# EAGLE design beagle2can (EAGLE 7.7.0)

## Sheet 1 of 2
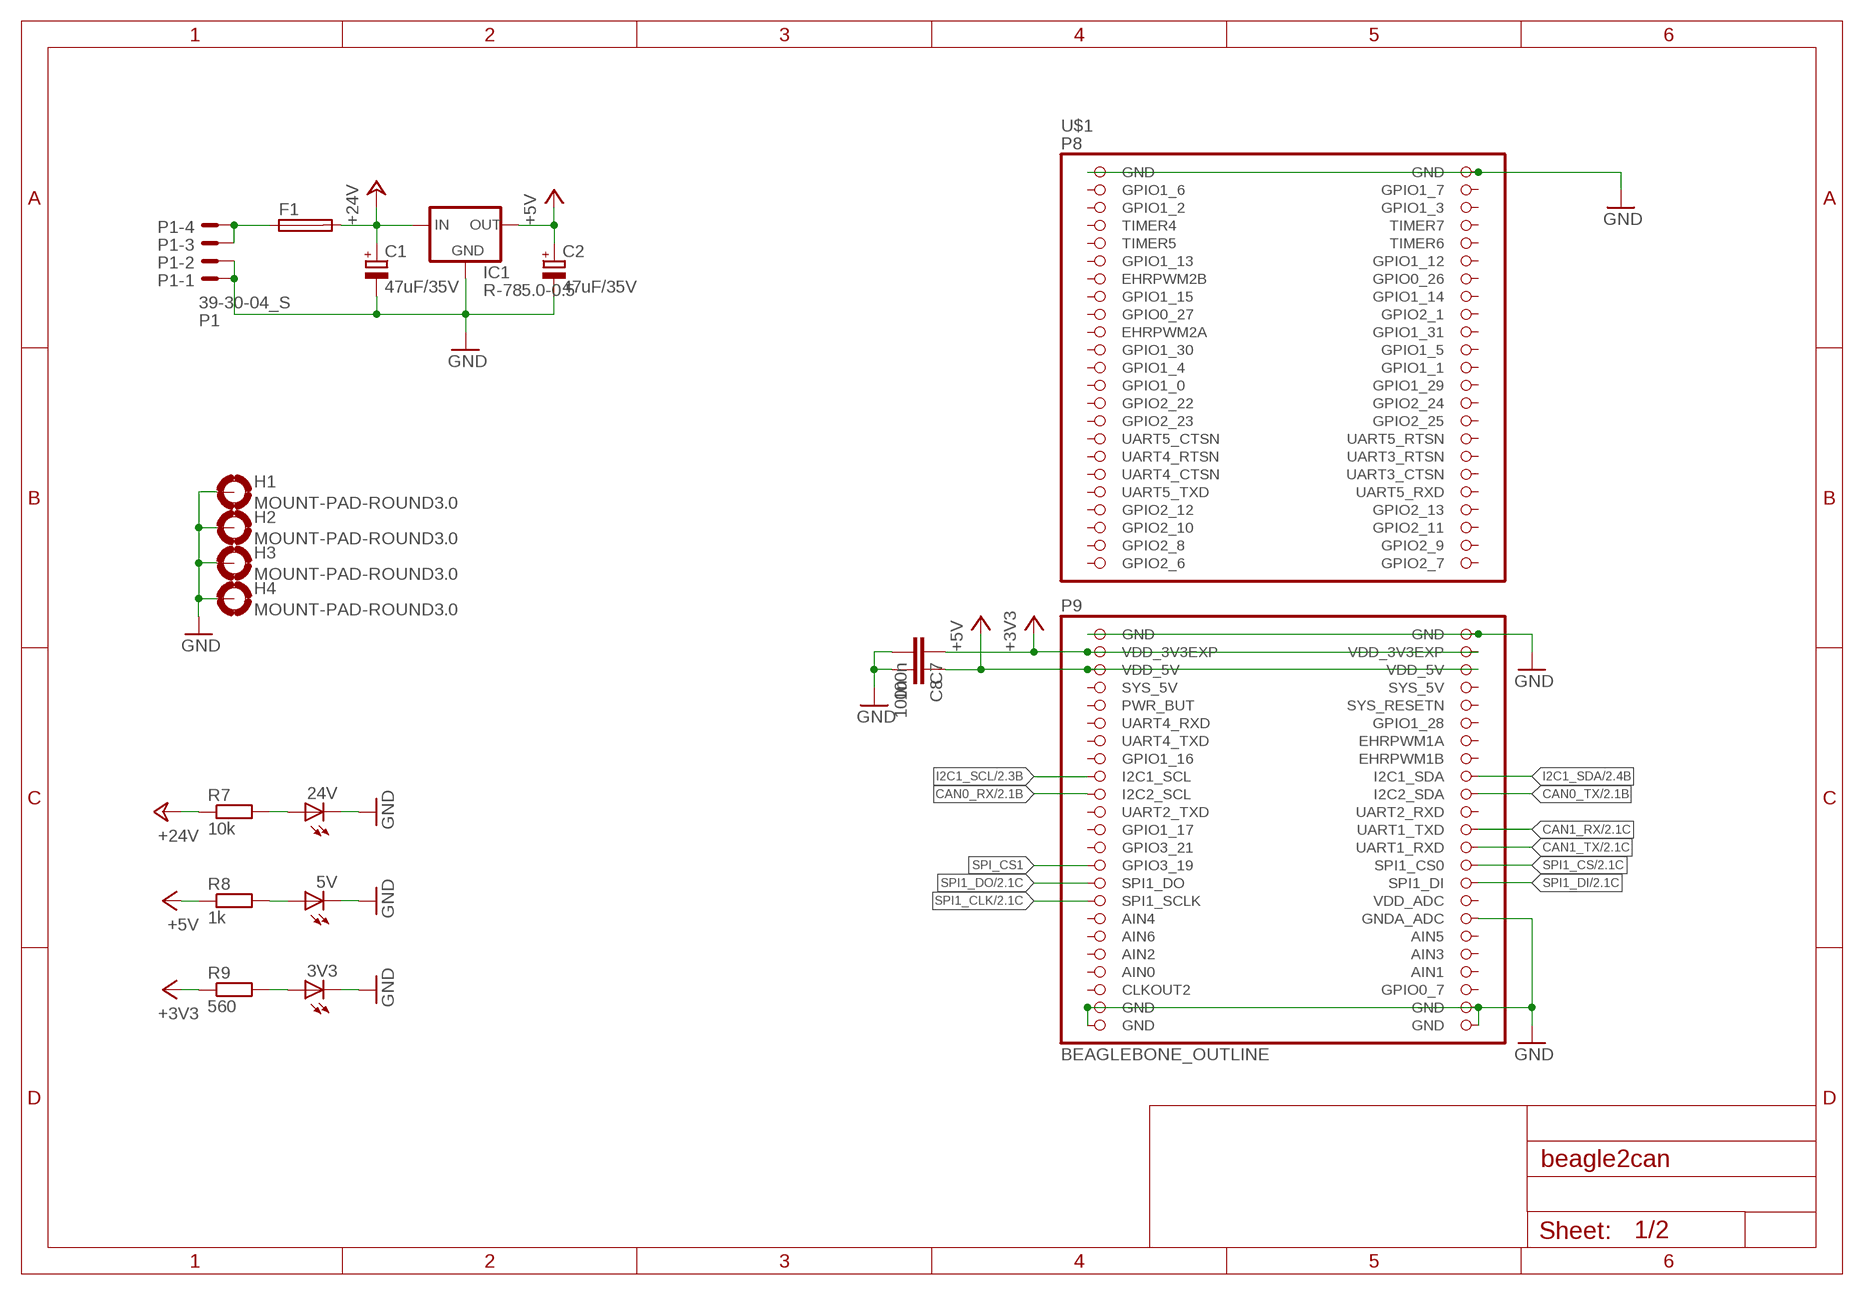
[diagram p0: schematic, sheet 1]

### Parts
3V3  LEDCHIP-LED0805  [CHIP-LED0805]
5V  LEDCHIP-LED0805  [CHIP-LED0805]
24V  LEDCHIP-LED0805  [CHIP-LED0805]
C1  47uF/35V  CPOL-EUD  [PANASONIC_D]
C2  47uF/35V  CPOL-EUD  [PANASONIC_D]
C7  100n  C-EUC0603  [C0603]
C8  100n  C-EUC0603  [C0603]
F1  TE5  [TE5]
H1  MOUNT-PAD-ROUND3.0  [3,0-PAD]
H2  MOUNT-PAD-ROUND3.0  [3,0-PAD]
H3  MOUNT-PAD-ROUND3.0  [3,0-PAD]
H4  MOUNT-PAD-ROUND3.0  [3,0-PAD]
IC1  R-785.0-0.5  [SIP3]
P1  39-30-04_S  [39-30-?04?]
R7  10k  R-EU_R0805  [R0805]
R8  1k  R-EU_R0805  [R0805]
R9  560  R-EU_R0805  [R0805]
U$1  BEAGLEBONE_OUTLINE  [BEAGLEBONE_SHIELD]

### Nets
+3V3: C7.1 R9.1 U$1.49(VDD_3V3EXP) U$1.50(VDD_3V3EXP) ; also sheet 2
+5V: C2.+ C8.1 IC1.3(OUT) R8.1 U$1.51(VDD_5V) U$1.52(VDD_5V) ; also sheet 2
+24V: C1.+ F1.2 IC1.1(IN) R7.1
CAN0_RX: U$1.65(I2C2_SCL) ; also sheet 2
CAN0_TX: U$1.66(I2C2_SDA) ; also sheet 2
CAN1_RX: U$1.70(UART1_TXD) ; also sheet 2
CAN1_TX: U$1.72(UART1_RXD) ; also sheet 2
CON_24V: F1.1 P1.3 P1.4 ; also sheet 2
GND: 3V3.C 5V.C 24V.C C1.- C2.- C7.2 C8.2 H1.B3,0(MOUNT) H2.B3,0(MOUNT) H3.B3,0(MOUNT) H4.B3,0(MOUNT) IC1.2(GND) P1.1 P1.2 U$1.1(GND) U$1.2(GND) U$1.47(GND) U$1.48(GND) U$1.80(GNDA_ADC) U$1.89(GND) U$1.90(GND) U$1.91(GND) U$1.92(GND) ; also sheet 2
I2C1_SCL: U$1.63(I2C1_SCL) ; also sheet 2
I2C1_SDA: U$1.64(I2C1_SDA) ; also sheet 2
N$1: 5V.A R8.2
N$2: 24V.A R7.2
N$3: 3V3.A R9.2
SPI1_CLK: U$1.77(SPI1_SCLK) ; also sheet 2
SPI1_CS: U$1.74(SPI1_CS0) ; also sheet 2
SPI1_DI: U$1.76(SPI1_DI) ; also sheet 2
SPI1_DO: U$1.75(SPI1_DO) ; also sheet 2
SPI_CS1: U$1.73(GPIO3_19)
Unconnected: U$1.3(GPIO1_6) U$1.4(GPIO1_7) U$1.5(GPIO1_2) U$1.6(GPIO1_3) U$1.7(TIMER4) U$1.8(TIMER7) U$1.9(TIMER5) U$1.10(TIMER6) U$1.11(GPIO1_13) U$1.12(GPIO1_12) U$1.13(EHRPWM2B) U$1.14(GPIO0_26) U$1.15(GPIO1_15) U$1.16(GPIO1_14) U$1.17(GPIO0_27) U$1.18(GPIO2_1) U$1.19(EHRPWM2A) U$1.20(GPIO1_31) U$1.21(GPIO1_30) U$1.22(GPIO1_5) U$1.23(GPIO1_4) U$1.24(GPIO1_1) U$1.25(GPIO1_0) U$1.26(GPIO1_29) U$1.27(GPIO2_22) U$1.28(GPIO2_24) U$1.29(GPIO2_23) U$1.30(GPIO2_25) U$1.31(UART5_CTSN) U$1.32(UART5_RTSN) U$1.33(UART4_RTSN) U$1.34(UART3_RTSN) U$1.35(UART4_CTSN) U$1.36(UART3_CTSN) U$1.37(UART5_TXD) U$1.38(UART5_RXD) U$1.39(GPIO2_12) U$1.40(GPIO2_13) U$1.41(GPIO2_10) U$1.42(GPIO2_11) U$1.43(GPIO2_8) U$1.44(GPIO2_9) U$1.45(GPIO2_6) U$1.46(GPIO2_7) U$1.54(SYS_5V) U$1.55(PWR_BUT) U$1.56(SYS_RESETN) U$1.57(UART4_RXD) U$1.58(GPIO1_28) U$1.59(UART4_TXD) U$1.60(EHRPWM1A) U$1.61(GPIO1_16) U$1.62(EHRPWM1B) U$1.67(UART2_TXD) U$1.68(UART2_RXD) U$1.69(GPIO1_17) U$1.71(GPIO3_21) U$1.78(VDD_ADC) U$1.79(AIN4) U$1.81(AIN6) U$1.82(AIN5) U$1.83(AIN2) U$1.84(AIN3) U$1.86(AIN1) U$1.87(CLKOUT2) U$1.88(GPIO0_7)

## Sheet 2 of 2
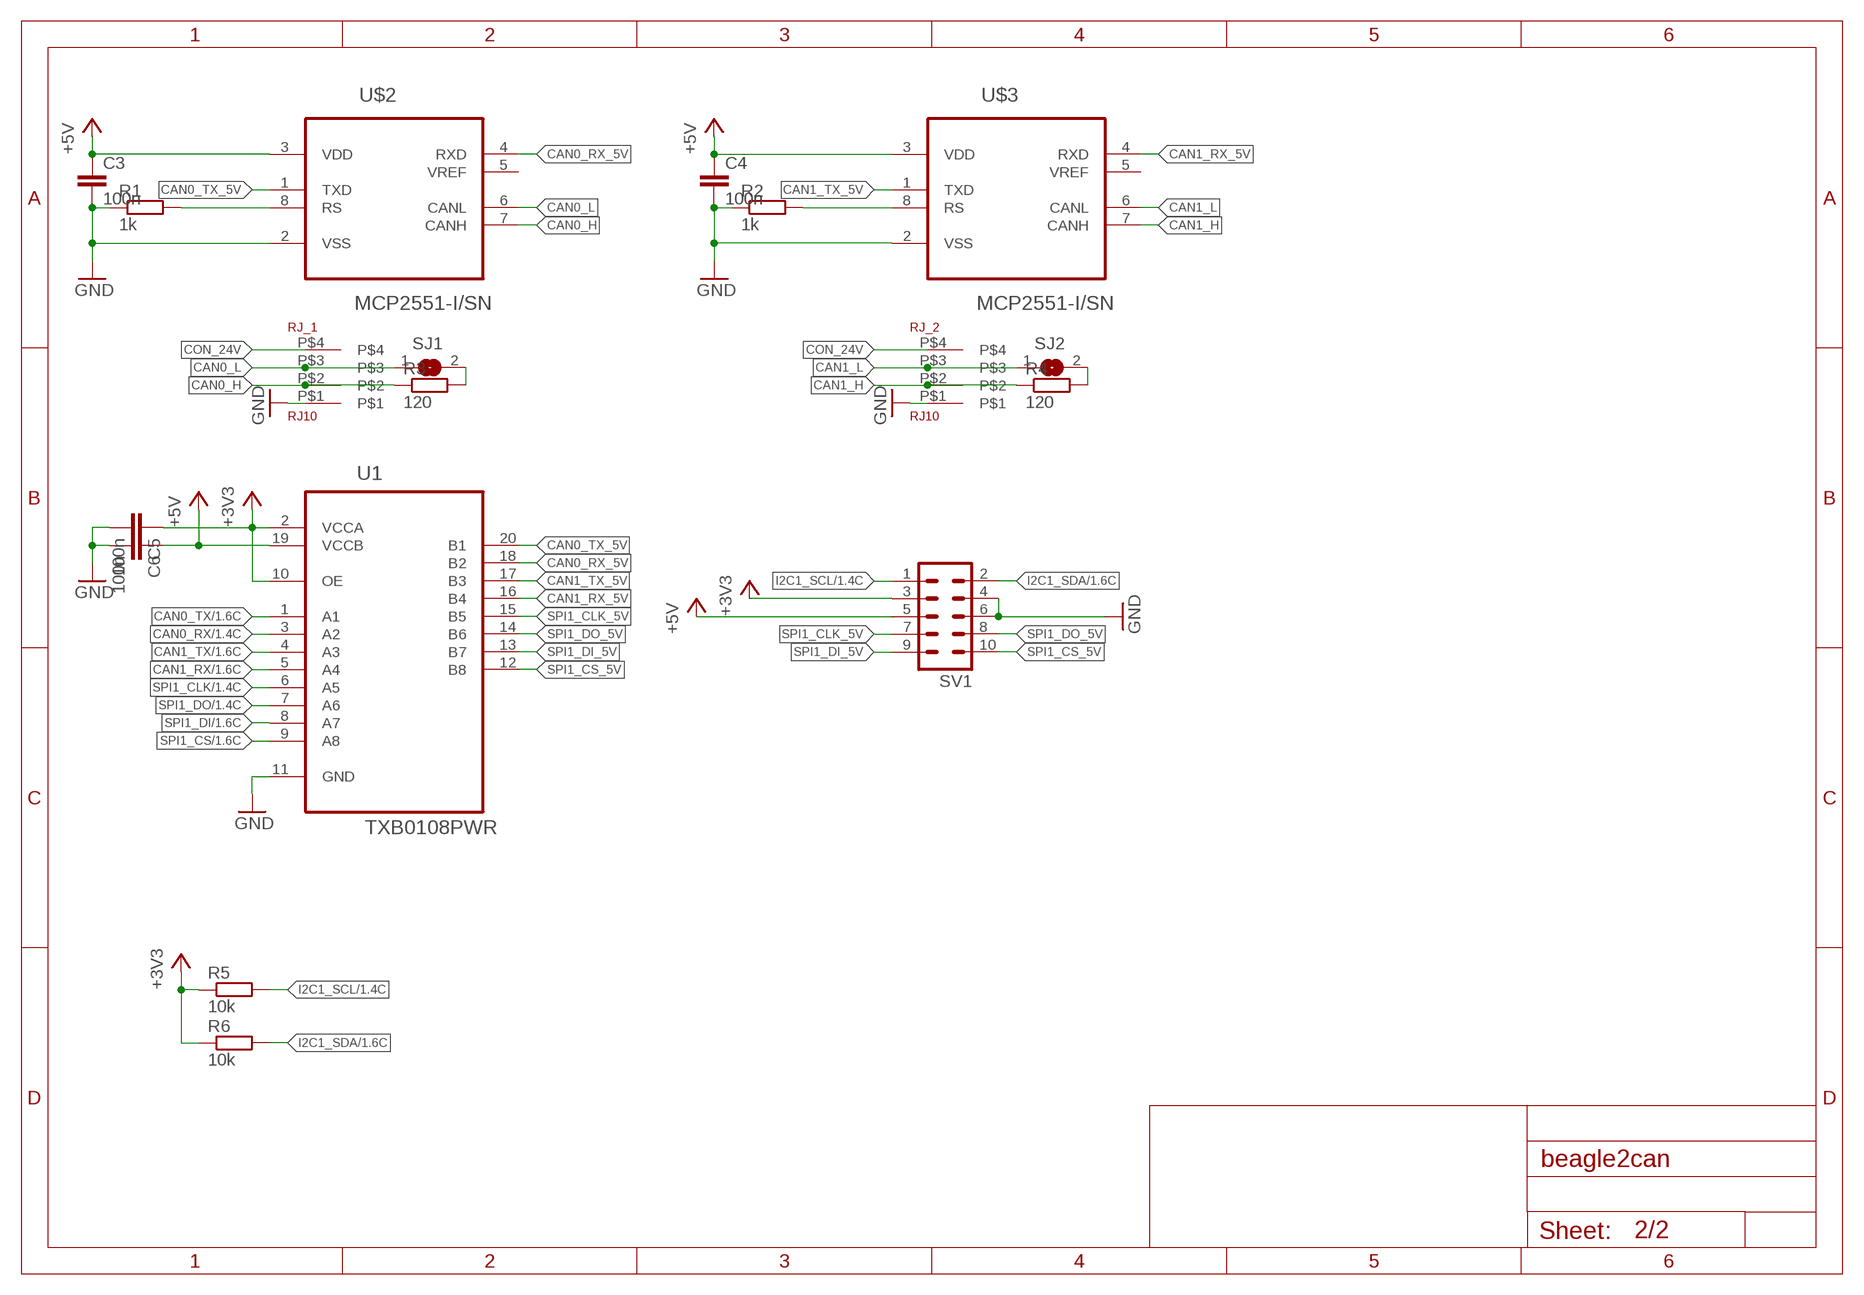
[diagram p1: schematic, sheet 2]

### Parts
C3  100n  C-EUC0603  [C0603]
C4  100n  C-EUC0603  [C0603]
C5  100n  C-EUC0603  [C0603]
C6  100n  C-EUC0603  [C0603]
R1  1k  R-EU_R0805  [R0805]
R2  1k  R-EU_R0805  [R0805]
R3  120  R-EU_R0805  [R0805]
R4  120  R-EU_R0805  [R0805]
R5  10k  R-EU_R0805  [R0805]
R6  10k  R-EU_R0805  [R0805]
RJ_1  RJ10  [RJ10]
RJ_2  RJ10  [RJ10]
SJ1  SJ  [SJ]
SJ2  SJ  [SJ]
SV1  ML10L  [ML10L]
U1  TXB0108PWR  [SOP65P640X120-20N]
U$2  MCP2551-I/SN  [SOIC127P600X175-8N]
U$3  MCP2551-I/SN  [SOIC127P600X175-8N]

### Nets
+3V3: C5.1 R5.1 R6.1 SV1.3 U1.2(VCCA) U1.10(OE) ; also sheet 1
+5V: C3.1 C4.1 C6.1 SV1.5 U1.19(VCCB) U$2.3(VDD) U$3.3(VDD) ; also sheet 1
CAN0_H: R3.1 RJ_1.P$2 U$2.7(CANH)
CAN0_L: RJ_1.P$3 SJ1.1 U$2.6(CANL)
CAN0_R_TERM: R3.2 SJ1.2
CAN0_RS: R1.2 U$2.8(RS)
CAN0_RX: U1.3(A2) ; also sheet 1
CAN0_RX_5V: U1.18(B2) U$2.4(RXD)
CAN0_TX: U1.1(A1) ; also sheet 1
CAN0_TX_5V: U1.20(B1) U$2.1(TXD)
CAN1_H: R4.1 RJ_2.P$2 U$3.7(CANH)
CAN1_L: RJ_2.P$3 SJ2.1 U$3.6(CANL)
CAN1_R_TERM: R4.2 SJ2.2
CAN1_RS: R2.2 U$3.8(RS)
CAN1_RX: U1.5(A4) ; also sheet 1
CAN1_RX_5V: U1.16(B4) U$3.4(RXD)
CAN1_TX: U1.4(A3) ; also sheet 1
CAN1_TX_5V: U1.17(B3) U$3.1(TXD)
CON_24V: RJ_1.P$4 RJ_2.P$4 ; also sheet 1
GND: C3.2 C4.2 C5.2 C6.2 R1.1 R2.1 RJ_1.P$1 RJ_2.P$1 SV1.4 SV1.6 U1.11(GND) U$2.2(VSS) U$3.2(VSS) ; also sheet 1
I2C1_SCL: R5.2 SV1.1 ; also sheet 1
I2C1_SDA: R6.2 SV1.2 ; also sheet 1
SPI1_CLK: U1.6(A5) ; also sheet 1
SPI1_CLK_5V: SV1.7 U1.15(B5)
SPI1_CS: U1.9(A8) ; also sheet 1
SPI1_CS_5V: SV1.10 U1.12(B8)
SPI1_DI: U1.8(A7) ; also sheet 1
SPI1_DI_5V: SV1.9 U1.13(B7)
SPI1_DO: U1.7(A6) ; also sheet 1
SPI1_DO_5V: SV1.8 U1.14(B6)
Unconnected: U$2.5(VREF) U$3.5(VREF)

## Power pins joined to a net without a drawn wire
AIN0: U$1.85(AIN0)
SYS_5V: U$1.53(SYS_5V)

## Library data of the parts
3V3 5V 24V = led:LED: LED OSRAM: - CHIPLED LG R971, LG N971, LY N971, LG Q971, LY Q971, LO R971, LY R971 LH N974, LH R974 LS Q976, LO Q976, LY Q976 LO Q996 - Hyper CHIPLED LW Q18S LB Q993, LB Q99A, LB R99A - SideLED LS A670, LO A670, LY A670, LG A670, LP A670 LB A673, LV A673, LT A673, LW A673 LH A674 LY A675 LS A676, LA A676, LO A676, LY A676, LW A676 LS A679, LY A679, LG A679 - Hyper Micro SIDELED® LS Y876, LA Y876, LO Y876, LY Y876 LT Y87S - SmartLED LW L88C, LW L88S LB L89C, LB L89S, LG L890 LS L89K, LO L89K, LY L89K LS L896, LA L896, LO L896, LY L896 - TOPLED LS T670, LO T670, LY T670, LG T670, LP T670 LSG T670, LSP T670, LSY T670, LOP T670, LYG T670 LG T671, LOG T671, LSG T671 LB T673, LV T673, LT T673, LW T673 LH T674 LS T676, LA T676, LO T676, LY T676, LB T676, LH T676, LSB T676, LW T676 LB T67C, LV T67C, LT T67C, LS T67K, LO T67K, LY T67K, LW E67C LS E67B, LA E67B, LO E67B, LY E67B, LB E67C, LV E67C, LT E67C LW T67C LS T679, LY T679, LG T679 LS T770, LO T770, LY T770, LG T770, LP T770 LB T773, LV T773, LT T773, LW T773 LH T774 LS E675, LA E675, LY E675, LS T675 LS T776, LA T776, LO T776, LY T776, LB T776 LHGB T686 LT T68C, LB T68C - Hyper Mini TOPLED® LB M676 - Mini TOPLED Santana® LG M470 LS M47K, LO M47K, LY M47K Source: http://www.osram.convergy.de LUXEON: - LUMILED® LXK2-PW12-R00, LXK2-PW12-S00, LXK2-PW14-U00, LXK2-PW14-V00 LXK2-PM12-R00, LXK2-PM12-S00, LXK2-PM14-U00 LXK2-PE12-Q00, LXK2-PE12-R00, LXK2-PE12-S00, LXK2-PE14-T00, LXK2-PE14-U00 LXK2-PB12-K00, LXK2-PB12-L00, LXK2-PB12-M00, LXK2-PB14-N00, LXK2-PB14-P00, LXK2-PB14-Q00 LXK2-PR12-L00, LXK2-PR12-M00, LXK2-PR14-Q00, LXK2-PR14-R00 LXK2-PD12-Q00, LXK2-PD12-R00, LXK2-PD12-S00 LXK2-PH12-R00, LXK2-PH12-S00 LXK2-PL12-P00, LXK2-PL12-Q00, LXK2-PL12-R00 Source: www.luxeon.com KINGBRIGHT: KA-3528ASYC Source: www.kingbright.com
C1 C2 = rcl:CPOL-EU: POLARIZED CAPACITOR, European symbol
C3-C8 = rcl:C-EU: CAPACITOR, European symbol
F1 = fuse:TE5: FUSE Wickmann; OC_FARNELL: unknown; OC_NEWARK: unknown
H1-H4 = holes:MOUNT-PAD-ROUND: MOUNTING PAD, round
IC1 = r-78xx_10:R-78*-0.5: Innoline R-78xx-0.5 Series Switching Regulators - 0.5A, Standard Source: http://www.recom-international.com/pdf/Innoline/R-78xx-0.5.pdf; MF: Recom; MPN: R-785.0-05; OC_FARNELL: 1793142; OC_NEWARK: 62X9541
P1 = con-molex-mini-fit:39-30-?04?_S: HEADER
R1-R9 = rcl:R-EU_: RESISTOR, European symbol
RJ_1 RJ_2 = ownParts:RJ10
SJ1 SJ2 = jumper:SJ: SMD solder JUMPER
SV1 = con-ml:ML10L: HARTING; OC_FARNELL: unknown; OC_NEWARK: unknown
U1 = TI-TXB0108PWR:TXB0108PWR: 8-BIT BIDIRECTIONAL VOLTAGE-LEVEL TRANSLATOR; MPN: TXB0108PWR; OC_FARNELL: 1494945; OC_NEWARK: 27M1151; PACKAGE: TSSOP-20; SUPPLIER: Texas Instruments
U$1 = ownParts:BEAGLEBONE_OUTLINE: Should match A3 pinout - but not completely tested
U$2 U$3 = Microchip-MCP2551-I_SN:MCP2551-I/SN: High-Speed CAN Transceiver; MPN: MCP2551-I/SN; OC_FARNELL: 9758569; OC_NEWARK: 69K7604; PACKAGE: SOIC-8; SUPPLIER: Microchip

## Board
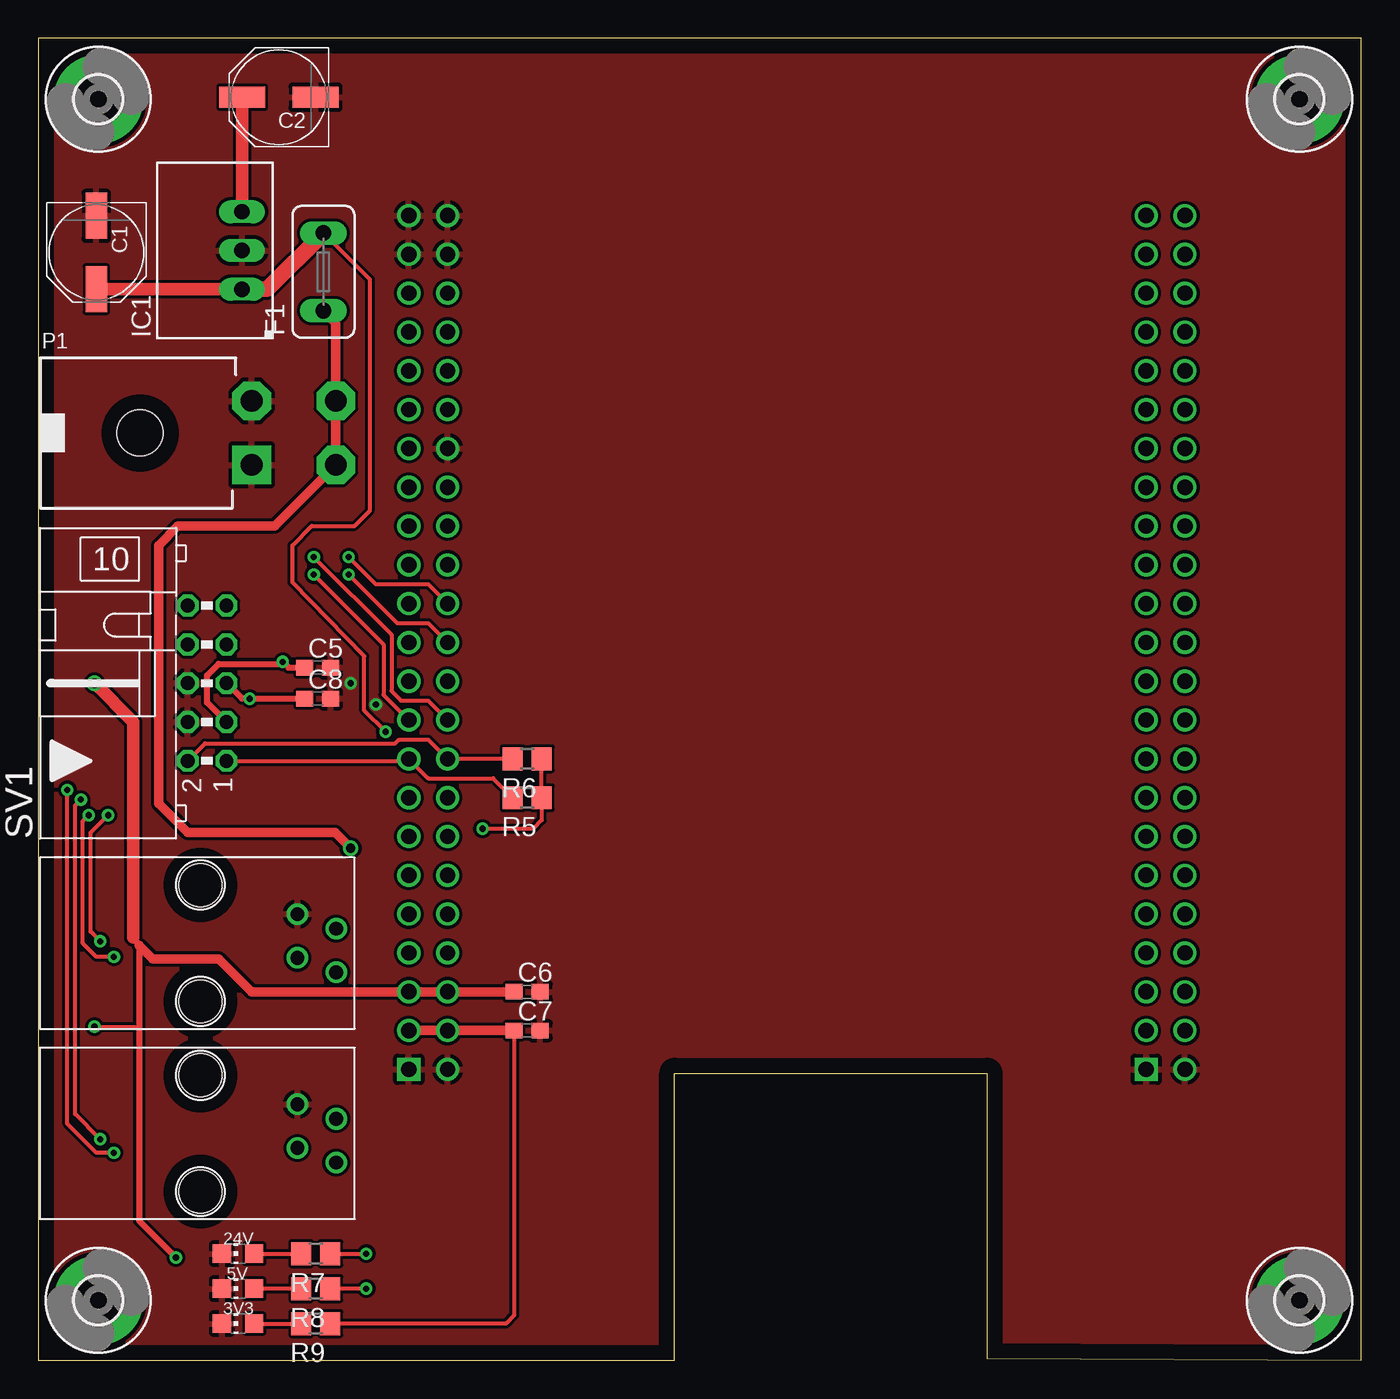
[diagram p2: board, top side]
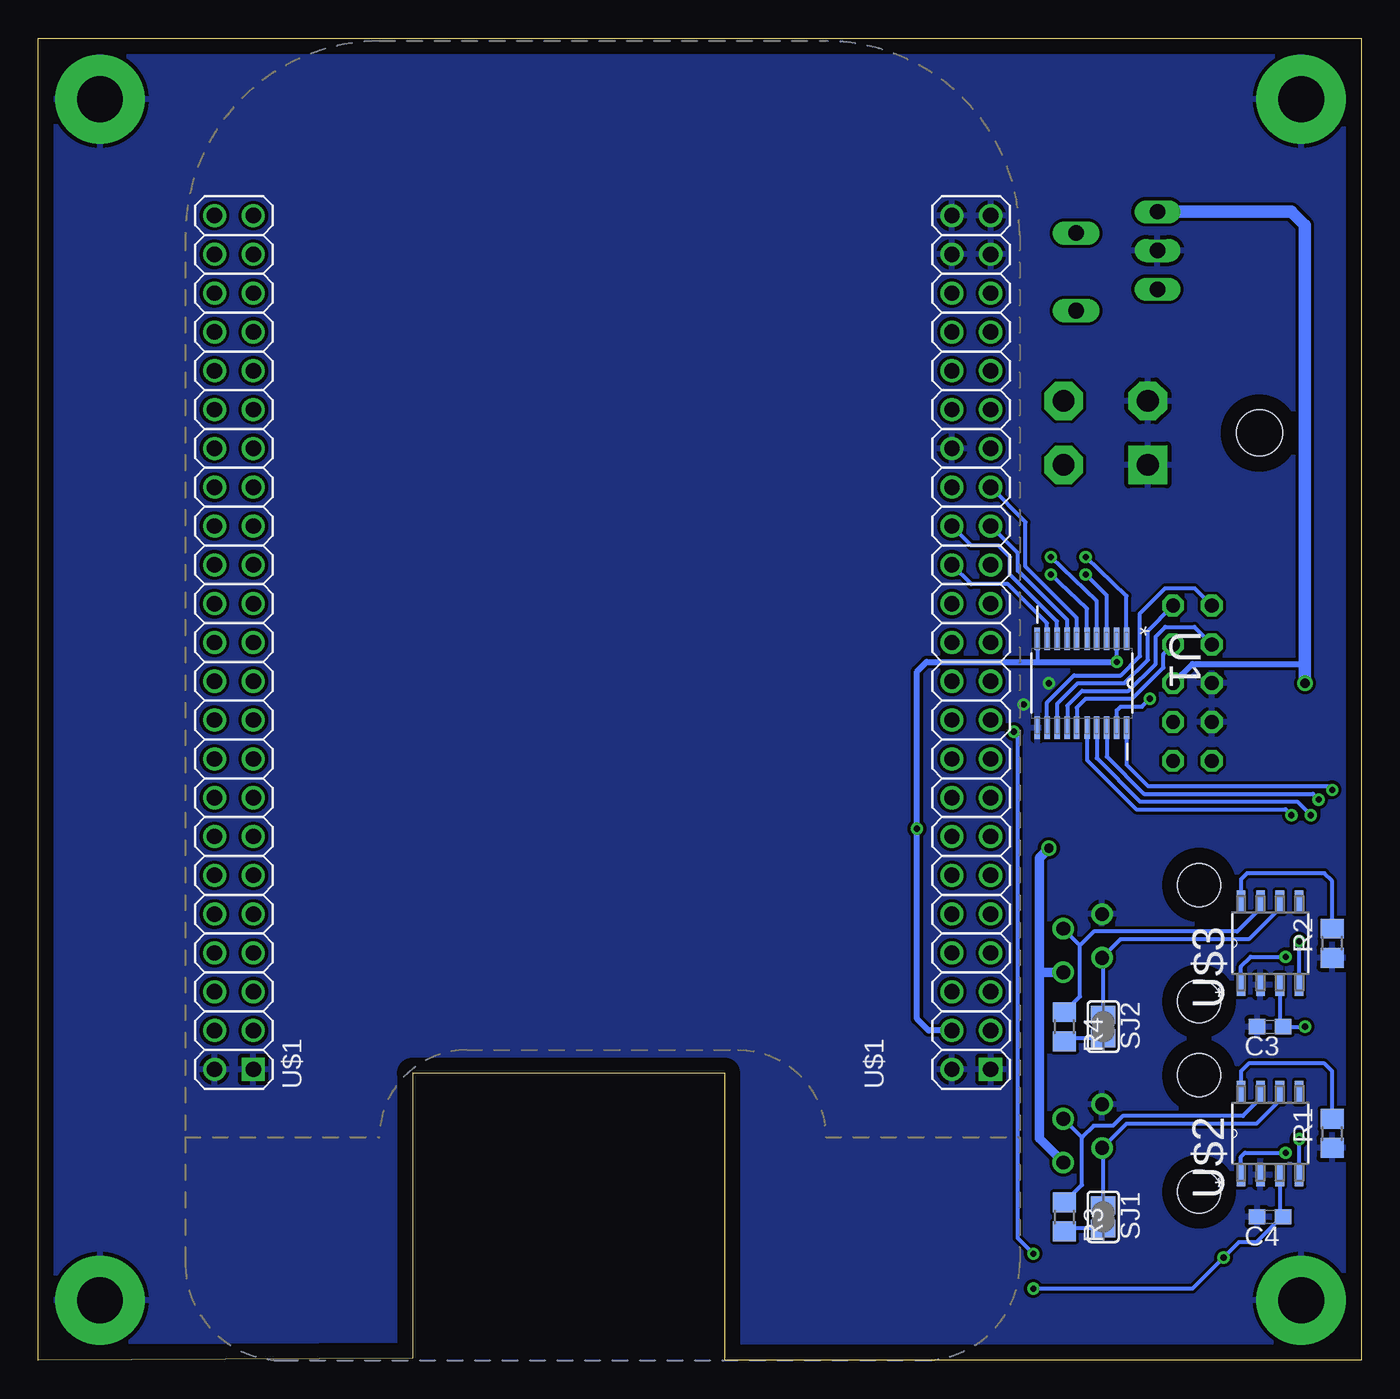
[diagram p3: board, bottom side, seen from below]

Size 86.59 x 86.54 mm. Coordinates in mm from the lower left corner, seen from the top.
Outline: 0,0 41.66,0 41.66,18.8 62.1,18.8 62.1,0.13 86.59,0 86.59,86.54 0,86.54 0,0
Copper layers (1*16): Top 0.035mm / dielectric 1.5mm / Bottom 0.035mm
Design rules "8mils": minimum track width 8mil, minimum drill 0.6mm, track to track 8mil, track to pad 8mil, pad to pad 8mil, via to via 8mil, smd to smd 8mil, copper to edge 40mil, drill to drill 10mil, minimum pad ring 10mil, minimum via ring 8mil, stop-mask expansion 0mil, vias tented up to drill 0mil, thermal gap 10mil

### Footprints (pad centres in the part's own frame; a part is rotated, then mirrored left to right if it is on the bottom)
CHIP-LED0805 = smd 1.2 x 1.2: A 0,-1.05; C 0,1.05
PANASONIC_D = smd 3 x 1.4: + 2.4,0; - -2.4,0
C0603 = smd 1.1 x 1: 1 -0.85,0; 2 0.85,0
TE5 = drill 1.016 long: 1 -2.54,0; 2 2.54,0
3,0-PAD = drill 3 pad 5.842: B3,0 0,0
SIP3 = drill 1 long: 1 -2.54,0; 2 0,0; 3 2.54,0
39-30-?04? = drill 1.422 pad 2.54 square: 1 2.095,0 | drill 1.422 pad 2.54 octagon: 2 -2.095,0; 3 2.095,5.512; 4 -2.095,5.512 | hole 3: 0,-7.3
R0805 = smd 1.3 x 1.5: 1 -0.95,0; 2 0.95,0
RJ10 = drill 0.9: P$1 -1.905,6.55; P$2 -0.953,9.09; P$3 0.953,6.55; P$4 1.905,9.09 | hole 2.8: -3.81,0.2; 3.81,0.2
SJ = smd 1.168 x 1.6: 1 -0.762,0; 2 0.762,0
ML10L = drill 0.914 octagon: 1 -5.08,-1.27; 2 -5.08,1.27; 3 -2.54,-1.27; 4 -2.54,1.27; 5 0,-1.27; 6 0,1.27; 7 2.54,-1.27; 8 2.54,1.27; 9 5.08,-1.27; 10 5.08,1.27
SOP65P640X120-20N = smd 1.473 x 0.356: 1 -2.921,2.921; 2 -2.921,2.286; 3 -2.921,1.626; 4 -2.921,0.965; 5 -2.921,0.33; 6 -2.921,-0.33; 7 -2.921,-0.965; 8 -2.921,-1.626; 9 -2.921,-2.286; 10 -2.921,-2.921; 11 2.921,-2.921; 12 2.921,-2.286; 13 2.921,-1.626; 14 2.921,-0.965; 15 2.921,-0.33; 16 2.921,0.33; 17 2.921,0.965; 18 2.921,1.626; 19 2.921,2.286; 20 2.921,2.921
BEAGLEBONE_SHIELD = drill 1 square: 1 4.445,19.05; 47 52.705,19.05 | drill 1: 2 1.905,19.05; 3 4.445,21.59; 4 1.905,21.59; 5 4.445,24.13; 6 1.905,24.13; 7 4.445,26.67; 8 1.905,26.67; 9 4.445,29.21; 10 1.905,29.21; 11 4.445,31.75; 12 1.905,31.75; 13 4.445,34.29; 14 1.905,34.29; 15 4.445,36.83; 16 1.905,36.83; 17 4.445,39.37; 18 1.905,39.37; 19 4.445,41.91; 20 1.905,41.91; 21 4.445,44.45; 22 1.905,44.45; 23 4.445,46.99; 24 1.905,46.99; 25 4.445,49.53; 26 1.905,49.53; 27 4.445,52.07; 28 1.905,52.07; 29 4.445,54.61; 30 1.905,54.61; 31 4.445,57.15; 32 1.905,57.15; 33 4.445,59.69; 34 1.905,59.69; 35 4.445,62.23; 36 1.905,62.23; 37 4.445,64.77; 38 1.905,64.77; 39 4.445,67.31; 40 1.905,67.31; 41 4.445,69.85; 42 1.905,69.85; 43 4.445,72.39; 44 1.905,72.39; 45 4.445,74.93; 46 1.905,74.93; 48 50.165,19.05; 49 52.705,21.59; 50 50.165,21.59; 51 52.705,24.13; 52 50.165,24.13; 53 52.705,26.67; 54 50.165,26.67; 55 52.705,29.21; 56 50.165,29.21; 57 52.705,31.75; 58 50.165,31.75; 59 52.705,34.29; 60 50.165,34.29; 61 52.705,36.83; 62 50.165,36.83; 63 52.705,39.37; 64 50.165,39.37; 65 52.705,41.91; 66 50.165,41.91; 67 52.705,44.45; 68 50.165,44.45; 69 52.705,46.99; 70 50.165,46.99; 71 52.705,49.53; 72 50.165,49.53; 73 52.705,52.07; 74 50.165,52.07; 75 52.705,54.61; 76 50.165,54.61; 77 52.705,57.15; 78 50.165,57.15; 79 52.705,59.69; 80 50.165,59.69; 81 52.705,62.23; 82 50.165,62.23; 83 52.705,64.77; 84 50.165,64.77; 85 52.705,67.31; 86 50.165,67.31; 87 52.705,69.85; 88 50.165,69.85; 89 52.705,72.39; 90 50.165,72.39; 91 52.705,74.93; 92 50.165,74.93
SOIC127P600X175-8N = smd 1.473 x 0.559: 1 -2.718,1.905; 2 -2.718,0.635; 3 -2.718,-0.635; 4 -2.718,-1.905; 5 2.718,-1.905; 6 2.718,-0.635; 7 2.718,0.635; 8 2.718,1.905

### Placement (x,y rotation side)
3V3  13.08,2.41 90 top
5V  13.08,4.7 90 top
24V  13.08,6.99 90 top
C1  3.81,72.52 270 top
C2  15.75,82.68 180 top
C3  5.97,21.84 180 bottom
C4  5.97,9.4 180 bottom
C5  18.29,45.34 0 top
C6  32,24.13 0 top
C7  32,21.59 0 top
C8  18.29,43.31 0 top
F1  18.67,71.25 90 top
H1  3.94,3.94 0 top
H2  3.94,82.55 0 top
H3  82.55,82.55 0 top
H4  82.55,3.94 0 top
IC1  13.34,72.64 90 top
P1  39-30-04?_S  [39-30-?04?]  13.97,60.71 270 top
R1  1.91,14.86 90 bottom
R2  1.91,27.3 90 bottom
R3  19.43,9.4 270 bottom
R4  19.43,21.84 270 bottom
R5  32,36.83 180 top
R6  32,39.37 180 top
R7  18.16,6.99 180 top
R8  18.16,4.7 180 top
R9  18.16,2.41 180 top
RJ_1  10.41,14.86 270 top
RJ_2  10.41,27.3 270 top
SJ1  16.89,9.4 270 bottom
SJ2  16.89,21.84 270 bottom
SV1  11.05,44.32 90 top
U1  18.29,44.32 270 bottom
U$1  76.96,0 0 bottom
U$2  5.97,14.86 90 bottom
U$3  5.97,27.3 90 bottom

### Tracks (layer width: path | path; a pad name or v marks a point on that pad's centre or on a via)
+3V3  (via drill 0.4)
  Top 0.254: C7.1 31.15,2.96 30.61,2.41 R9.1 | R6.1 R5.1 32.95,35.37 32.38,34.8 v29.08,34.8
  Top 0.406: SV1.3 11.05,43.05 11.05,44.83 11.81,45.59 15.88,45.59 v16,45.72 16.38,45.34 C5.1
  Top 0.61: U$1.49 U$1.50 C7.1
  Bottom 0.254: v16,45.72 U1.2 | U1.10 21.21,45.72
  Bottom 0.406: v16,45.72 21.21,45.72 28.45,45.72 29.08,45.09 v29.08,34.8 29.08,22.35 28.32,21.59 U$1.50
+5V  (via drill 0.4, 0.6)
  Top 0.254: v21.46,4.7 R8.1 | v3.68,21.84 6.6,21.84
  Top 0.406: 6.22,27.69 6.6,27.18 6.6,21.84 6.6,9.14 v9.02,6.73 | SV1.5 13.34,43.31 v13.84,43.31 C8.1
  Top 0.61: C6.1 U$1.52 U$1.51 13.97,24.13 11.81,26.29 7.49,26.29 6.6,27.18
  Top 0.813: C2.+ 13.35,75.2 IC1.3 | 6.22,27.69 6.22,41.78 v3.68,44.32
  Bottom 0.254: C3.1 5.33,22.06 U$3.3 5.33,21.84 v3.68,21.84 | U$2.3 5.33,9.61 | 5.33,9.61 C4.1 | v21.46,4.7 11.05,4.7 v9.02,6.73 8,7.75 6.86,7.75 5.33,9.27 5.33,9.61 | U1.19 16,42.55 15.75,42.8 14.35,42.8 v13.84,43.31
  Bottom 0.406: SV1.5 11.05,45.59 3.68,45.59
  Bottom 0.813: IC1.3 4.57,75.18 3.68,74.3 3.68,45.59 v3.68,44.32
+24V  (via drill 0.4)
  Top 0.254: R7.1 v21.46,6.99 | F1.2 21.72,70.74 21.72,55.63 20.7,54.61 17.91,54.61 16.64,53.34 16.64,50.93 21.34,46.1 21.34,42.55 v22.73,41.15
  Top 0.61: 14.99,70.1 15.37,70.48
  Top 0.813: IC1.1 3.82,70.1 C1.+
  Top 1.016: IC1.1 14.99,70.1 F1.2
  Bottom 0.254: v21.46,6.99 22.48,8 22.48,40.89 v22.73,41.15
CAN0_H
  Bottom 0.254: R3.1 18.29,11.49 18.29,14.6 | 18.29,14.6 RJ_1.P$2 | U$2.7 6.6,17.14 7.75,16 15.62,16 16.26,15.37 17.52,15.37 18.29,14.6
CAN0_L
  Bottom 0.254: SJ1.1 16.89,13.83 RJ_1.P$3 15.37,15.49 6.86,15.49 5.33,17.02 U$2.6
CAN0_R_TERM
  Bottom 0.254: SJ1.2 19.24,8.64 R3.2
CAN0_RS
  Bottom 0.254: R1.2 1.91,18.92 2.41,19.43 7.37,19.43 7.87,18.92 U$2.8
CAN0_RX  (via drill 0.4)
  Top 0.254: U$1.65 22.61,43.56 22.61,46.86 v18.03,51.44
  Bottom 0.254: U1.3 16.66,50.06 v18.03,51.44
CAN0_RX_5V  (via drill 0.4)
  Top 0.254: v4.06,14.48 2.41,16.13 2.41,36.32 v2.79,36.7
  Bottom 0.254: U$2.4 v4.06,14.48 | v2.79,36.7 3.17,37.08 14.22,37.08 16.66,39.52 U1.18
CAN0_TX  (via drill 0.4)
  Top 0.254: v18.03,52.58 23.11,47.5 23.11,43.81 23.75,43.18 25.53,43.18 U$1.66
  Bottom 0.254: U1.1 15.37,50.04 v18.03,52.58
CAN0_TX_5V  (via drill 0.4)
  Top 0.254: v4.95,13.59 3.81,13.59 1.91,15.49 v1.91,37.34
  Bottom 0.254: U$2.1 7.87,13.34 7.62,13.59 v4.95,13.59 | v1.91,37.34 2.16,37.59 13.97,37.59 15.37,38.99 U1.20
CAN1_H
  Bottom 0.254: R4.1 18.41,23.81 18.41,27.17 | 18.41,27.17 RJ_2.P$2 | U$3.7 6.6,29.59 8.13,28.07 17.52,28.07 18.41,27.17
CAN1_L
  Bottom 0.254: SJ2.1 16.89,26.28 RJ_2.P$3 15.76,27.56 7.37,27.56 5.33,29.59 U$3.6
CAN1_R_TERM
  Bottom 0.254: SJ2.2 19.24,21.08 R4.2
CAN1_RS
  Bottom 0.254: R2.2 1.91,31.37 2.41,31.88 7.49,31.88 7.87,31.5 U$3.8
CAN1_RX  (via drill 0.4)
  Top 0.254: v20.32,51.44 23.5,48.26 25.53,48.26 U$1.70
  Bottom 0.254: U1.5 17.96,49.2 v20.32,51.44
CAN1_RX_5V  (via drill 0.4)
  Top 0.254: v4.06,27.43 3.43,28.07 3.43,34.54 v4.57,35.69
  Bottom 0.254: U$3.4 v4.06,27.43 | v4.57,35.69 4.95,36.07 14.73,36.07 17.96,39.29 U1.16
CAN1_TX  (via drill 0.4)
  Top 0.254: v20.32,52.58 22.1,50.8 25.53,50.8 U$1.72
  Bottom 0.254: U1.4 17.32,49.71 v20.32,52.58
CAN1_TX_5V  (via drill 0.4)
  Top 0.254: v4.95,26.42 3.81,26.42 2.92,27.3 2.92,35.31 v3.3,35.69
  Bottom 0.254: U$3.1 7.87,25.78 7.24,26.42 v4.95,26.42 | v3.3,35.69 4.19,36.58 14.48,36.58 17.32,39.42 U1.17
CON_24V  (via drill 0.6)
  Top 0.61: v20.45,33.53 19.43,34.54 9.78,34.54 7.87,36.45 7.87,53.34 9.14,54.61 15.48,54.61 P1.3 P1.4 19.48,67.89 F1.1
  Bottom 0.61: RJ_1.P$4 21.08,14.53 21.08,25.4 | RJ_2.P$4 21.08,25.4 | 21.08,25.4 21.08,32.89 v20.45,33.53
GND  (via drill 0.4)
  other vias: 20.45,44.32 22.1,42.93
  pour Bottom: 0,0 86.61,0 86.61,86.61 0,86.61
  pour Top: 0,0 86.61,0 86.61,86.61 0,86.61
I2C1_SCL
  Top 0.254: R5.2 29.78,38.1 25.53,38.1 U$1.63 24.13,39.24 SV1.1
I2C1_SDA
  Top 0.254: R6.2 U$1.64 25.53,40.64 23.62,40.64 23.37,40.39 10.92,40.39 SV1.2
N$1
  Top 0.254: R8.2 5V.A
N$2
  Top 0.254: 24V.A R7.2
N$3
  Top 0.254: 3V3.A R9.2
SPI1_CLK
  Bottom 0.254: U1.6 18.62,48.59 21.97,51.94 21.97,54.86 U$1.77
SPI1_CLK_5V
  Bottom 0.254: SV1.7 12.95,46.23 12.95,45.34 14.99,43.31 18.03,43.31 18.62,42.72 U1.15
SPI1_CS
  Bottom 0.254: U$1.74 25.53,50.8 23.11,50.8 20.57,48.26 U1.9
SPI1_CS_5V
  Bottom 0.254: SV1.10 10.92,50.55 12.83,50.55 14.48,48.9 14.48,46.1 15.75,44.83 18.8,44.83 20.57,43.05 U1.12
SPI1_DI
  Bottom 0.254: U$1.76 25.53,53.34 23.75,53.34 22.99,52.58 22.99,51.44 19.91,48.36 U1.8
SPI1_DI_5V
  Bottom 0.254: SV1.9 13.97,47.75 13.97,45.85 15.49,44.32 18.54,44.32 19.91,42.95 U1.13
SPI1_DO
  Bottom 0.254: U1.7 19.25,48.46 22.48,51.69 22.48,52.83 U$1.75
SPI1_DO_5V
  Bottom 0.254: SV1.8 10.92,48.01 12.83,48.01 13.46,47.37 13.46,45.59 15.24,43.81 18.29,43.81 19.25,42.85 U1.14